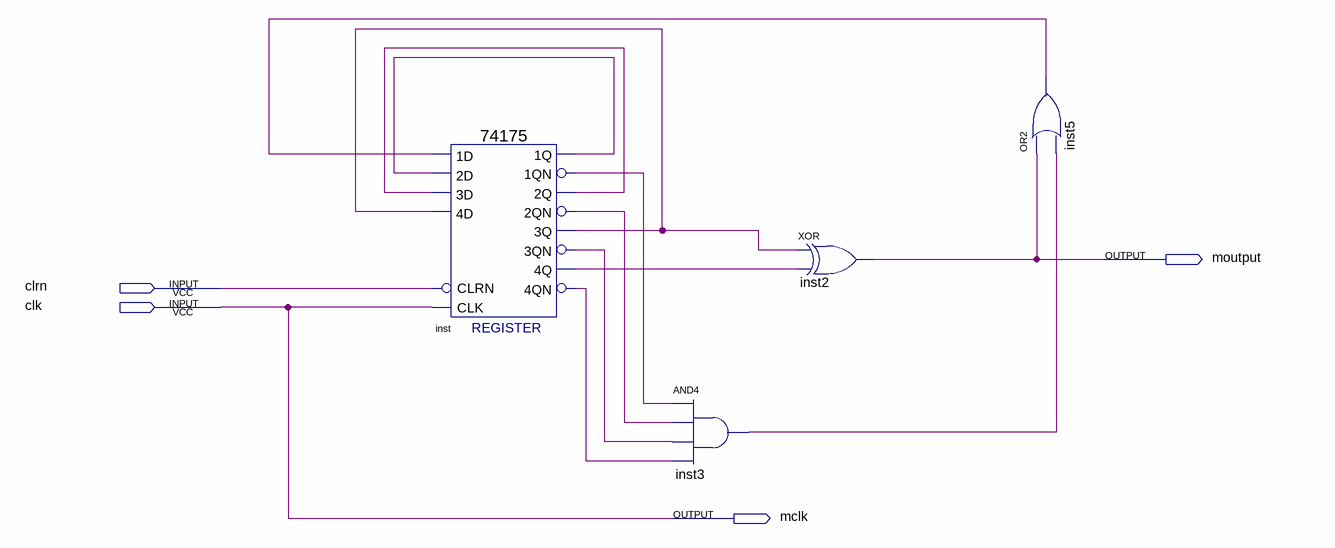
[diagram p0: schematic sheet]
// Quartus schematic mxulie.bdf as structural Verilog: 4 symbols, 4 pins
module mxulie (
  input  clrn,
  input  clk,
  output moutput,
  output mclk
);

  wire inst3_out, inst5_out, inst_1q, inst_1qn, inst_2q, inst_2qn, inst_3q, inst_3qn, inst_4q, inst_4qn;

  \74175  inst (
    .CLRN(clrn), .CLK(clk), .\3D (inst_2q), .\2D (inst_1q), .\1D (inst5_out), .\4D (inst_3q),
    .\1QN (inst_1qn), .\1Q (inst_1q), .\2QN (inst_2qn), .\3Q (inst_3q), .\2Q (inst_2q), .\4QN (inst_4qn),
    .\4Q (inst_4q), .\3QN (inst_3qn));
  and inst3 (inst3_out, inst_1qn, inst_2qn, inst_3qn, inst_4qn);
  xor inst2 (moutput, inst_3q, inst_4q);
  or inst5 (inst5_out, moutput, inst3_out);

  assign mclk = clk;
endmodule
